# Altium schematic sheet MCU.SchDoc
size A4
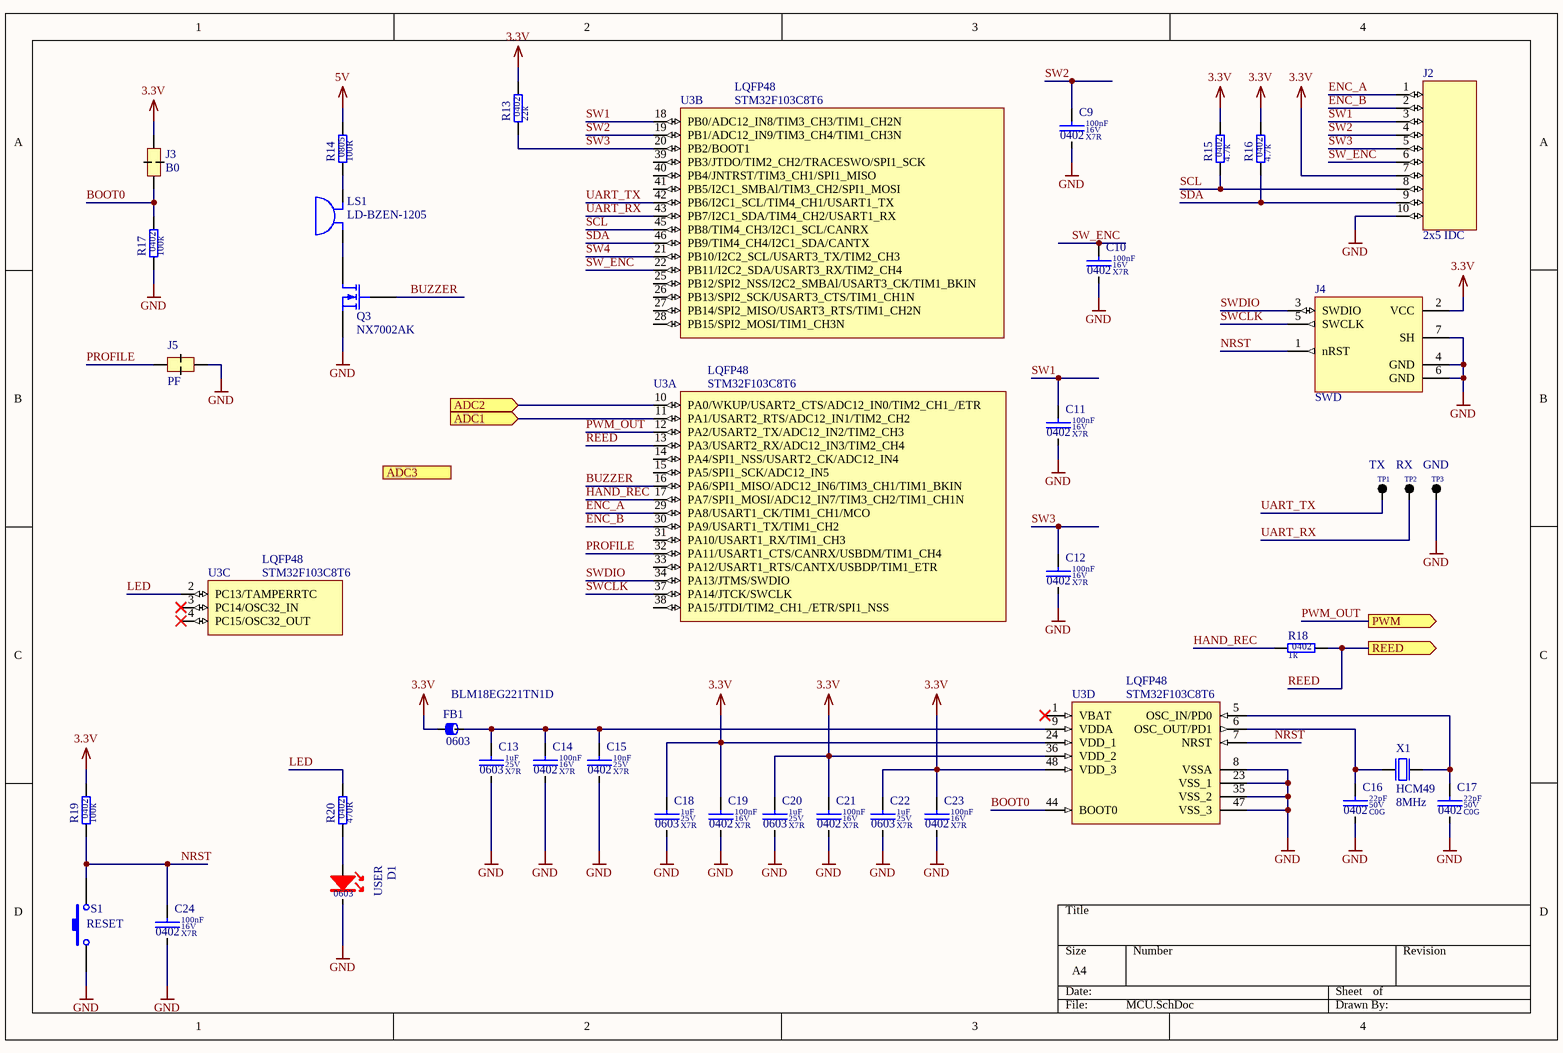
[diagram p0: MCU.SchDoc]

## Parts
C9  value 100nF  Dielectric: X7R  Voltage: 16V  SCH_Footprint: 0402  [C_0402_1005]  (hidden comment: Ceramic X7R)
C10  value 100nF  Dielectric: X7R  Voltage: 16V  SCH_Footprint: 0402  [C_0402_1005]  (hidden comment: Ceramic X7R)
C11  value 100nF  Dielectric: X7R  Voltage: 16V  SCH_Footprint: 0402  [C_0402_1005]  (hidden comment: Ceramic X7R)
C12  value 100nF  Dielectric: X7R  Voltage: 16V  SCH_Footprint: 0402  [C_0402_1005]  (hidden comment: Ceramic X7R)
C13  value 1uF  Dielectric: X7R  Voltage: 25V  SCH_Footprint: 0603  [C_0603_1608]  (hidden comment: Ceramic X7R)
C14  value 100nF  Dielectric: X7R  Voltage: 16V  SCH_Footprint: 0402  [C_0402_1005]  (hidden comment: Ceramic X7R)
C15  value 10nF  Dielectric: X7R  Voltage: 25V  SCH_Footprint: 0402  [C_0402_1005]  (hidden comment: Ceramic X7R)
C16  value 22pF  Dielectric: C0G  Voltage: 50V  SCH_Footprint: 0402  [C_0402_1005]  (hidden comment: Ceramic C0G)
C17  value 22pF  Dielectric: C0G  Voltage: 50V  SCH_Footprint: 0402  [C_0402_1005]  (hidden comment: Ceramic C0G)
C18  value 1uF  Dielectric: X7R  Voltage: 25V  SCH_Footprint: 0603  [C_0603_1608]  (hidden comment: Ceramic X7R)
C19  value 100nF  Dielectric: X7R  Voltage: 16V  SCH_Footprint: 0402  [C_0402_1005]  (hidden comment: Ceramic X7R)
C20  value 1uF  Dielectric: X7R  Voltage: 25V  SCH_Footprint: 0603  [C_0603_1608]  (hidden comment: Ceramic X7R)
C21  value 100nF  Dielectric: X7R  Voltage: 16V  SCH_Footprint: 0402  [C_0402_1005]  (hidden comment: Ceramic X7R)
C22  value 1uF  Dielectric: X7R  Voltage: 25V  SCH_Footprint: 0603  [C_0603_1608]  (hidden comment: Ceramic X7R)
C23  value 100nF  Dielectric: X7R  Voltage: 16V  SCH_Footprint: 0402  [C_0402_1005]  (hidden comment: Ceramic X7R)
C24  value 100nF  Dielectric: X7R  Voltage: 16V  SCH_Footprint: 0402  [C_0402_1005]  (hidden comment: Ceramic X7R)
D1  USER  SCH_Footprint: 0603  [OL_0603_1608]
FB1  value BLM18EG221TN1D  SCH_Footprint: 0603  [FB_0603_1608]  (hidden comment: Ferrite bead)
J2  2x5 IDC  [IDC 2x5 EDGE]
J3  B0  [SOLDER BRIDGE 0402]
J4  SWD  [TagConnectSWD]
J5  PF  [SOLDER BRIDGE 0402]
LS1  LD-BZEN-1205  [LD-BZEN-1205]
Q3  NX7002AK  [NX7002AK.215]
R13  value 22k  SCH_Footprint: 0402  [R_0402_1005]  (hidden comment: Resistor)
R14  value 100R  SCH_Footprint: 0805  [R_0805_2012]  (hidden comment: Resistor)
R15  value 4.7k  SCH_Footprint: 0402  [R_0402_1005]  (hidden comment: Resistor)
R16  value 4.7k  SCH_Footprint: 0402  [R_0402_1005]  (hidden comment: Resistor)
R17  value 100k  SCH_Footprint: 0402  [R_0402_1005]  (hidden comment: Resistor)
R18  value 1k  SCH_Footprint: 0402  [R_0402_1005]  (hidden comment: Resistor)
R19  value 100k  SCH_Footprint: 0402  [R_0402_1005]  (hidden comment: Resistor)
R20  value 470R  SCH_Footprint: 0402  [R_0402_1005]  (hidden comment: Resistor)
S1  RESET  [S_TACTSWITCH3x6]
TP1  TX  [TP_PAD]
TP2  RX  [TP_PAD]
TP3  GND  [TP_PAD]
U3  SCH_Footprint: LQFP48  [LQFP48_7x7]  (hidden comment: STM32F103C8T6)  (parts A,B,C,D of 4)
X1  value 8MHz  SCH_Footprint: HCM49  [X_HC49_SMD]  (hidden comment: 6MHz Crystal)

## Ports
ADC1 (in), ADC2 (in), ADC3 (in), PWM (out), REED (out)

## Nets
3.3V: C18.1 C19.1 C20.1 C21.1 C22.1 C23.1 FB1.1 J2.7 J3.1 J4.2(VCC) R13.2 R15.2 R16.2 R19.2 U3.24(VDD_1) U3.36(VDD_2) U3.48(VDD_3)
5V: R14.2
GND: C9.2 C10.2 C11.2 C12.2 C13.2 C14.2 C15.2 C16.2 C17.2 C18.2 C19.2 C20.2 C21.2 C22.2 C23.2 C24.2 D1.1(K) J2.10 J4.4(GND) J4.6(GND) J4.7(SH) J5.1 Q3.2(S) R17.1 S1.1 TP3.1(TP) U3.8(VSSA) U3.23(VSS_1) U3.35(VSS_2) U3.47(VSS_3)
ADC1: U3.11(PA1/USART2_RTS/ADC12_IN1/TIM2_CH2) ; port ADC1
ADC2: U3.10(PA0/WKUP/USART2_CTS/ADC12_IN0/TIM2_CH1_/ETR) ; port ADC2
BOOT0: J3.2 R17.2 U3.44(BOOT0)
BUZZER: Q3.1(G) U3.16(PA6/SPI1_MISO/ADC12_IN6/TIM3_CH1/TIM1_BKIN)
ENC_A: J2.1 U3.29(PA8/USART1_CK/TIM1_CH1/MCO)
ENC_B: J2.2 U3.30(PA9/USART1_TX/TIM1_CH2)
HAND_REC: R18.1 U3.17(PA7/SPI1_MOSI/ADC12_IN7/TIM3_CH2/TIM1_CH1N)
LED: R20.2 U3.2(PC13/TAMPERRTC)
NRST: C24.1 J4.1(nRST) R19.1 S1.2 U3.7(NRST)
PROFILE: J5.2 U3.32(PA11/USART1_CTS/CANRX/USBDM/TIM1_CH4)
PWM_OUT: U3.12(PA2/USART2_TX/ADC12_IN2/TIM2_CH3) ; port PWM
REED: R18.2 U3.13(PA3/USART2_RX/ADC12_IN3/TIM2_CH4) ; port REED
SCL: J2.8 R15.1 U3.45(PB8/TIM4_CH3/I2C1_SCL/CANRX)
SDA: J2.9 R16.1 U3.46(PB9/TIM4_CH4/I2C1_SDA/CANTX)
SW1: C11.1 J2.3 U3.18(PB0/ADC12_IN8/TIM3_CH3/TIM1_CH2N)
SW2: C9.1 J2.4 U3.19(PB1/ADC12_IN9/TIM3_CH4/TIM1_CH3N)
SW3: C12.1 J2.5 R13.1 U3.20(PB2/BOOT1)
SW4: U3.21(PB10/I2C2_SCL/USART3_TX/TIM2_CH3)
SW_ENC: C10.1 J2.6 U3.22(PB11/I2C2_SDA/USART3_RX/TIM2_CH4)
SWCLK: J4.5(SWCLK) U3.37(PA14/JTCK/SWCLK)
SWDIO: J4.3(SWDIO) U3.34(PA13/JTMS/SWDIO)
UART_RX: TP2.1(TP) U3.43(PB7/I2C1_SDA/TIM4_CH2/USART1_RX)
UART_TX: TP1.1(TP) U3.42(PB6/I2C1_SCL/TIM4_CH1/USART1_TX)
NetC13_1: C13.1 C14.1 C15.1 FB1.2 U3.9(VDDA)
NetC16_1: C16.1 U3.6(OSC_OUT/PD1) X1.1
NetC17_1: C17.1 U3.5(OSC_IN/PD0) X1.2
NetD1_2: D1.2(A) R20.1
NetLS1_1: LS1.1 R14.1
NetLS1_2: LS1.2 Q3.3(D)

Not connected (* = marked no-connect by the designer): U3 1(VBAT)* 3(PC14/OSC32_IN)* 4(PC15/OSC32_OUT)* 14(PA4/SPI1_NSS/USART2_CK/ADC12_IN4) 15(PA5/SPI1_SCK/ADC12_IN5) 25(PB12/SPI2_NSS/I2C2_SMBAl/USART3_CK/TIM1_BKIN) 26(PB13/SPI2_SCK/USART3_CTS/TIM1_CH1N) 27(PB14/SPI2_MISO/USART3_RTS/TIM1_CH2N) 28(PB15/SPI2_MOSI/TIM1_CH3N) 31(PA10/USART1_RX/TIM1_CH3) 33(PA12/USART1_RTS/CANTX/USBDP/TIM1_ETR) 38(PA15/JTDI/TIM2_CH1_/ETR/SPI1_NSS) 39(PB3/JTDO/TIM2_CH2/TRACESWO/SPI1_SCK) 40(PB4/JNTRST/TIM3_CH1/SPI1_MISO) 41(PB5/I2C1_SMBAl/TIM3_CH2/SPI1_MOSI)

## Library data of the parts
C9-C12 C14 C19 C21 C23 C24 = C_100nF_16V_X7R_0402_10: Capacitor; Manufacturer: Murata; Manufacturer Part Number: GRM155R71C104KA88D; Tolerance (%): 10; Part Number: C_100nF_16V_X7R_0402_10; HelpURL: https://www.mouser.com/ds/2/281/c02e-2905.pdf; Supplier 1: TME; Supplier 2: RS Components; Supplier 3: Farnell; Supplier 4: Mouser; Supplier Part Number 4: 81-GRM155R71C104KA88; Supplier 5: Digi-Key
C13 C18 C20 C22 = C_1uF_25V_X7R_0603_10: Capacitor; Manufacturer: Samsung; Manufacturer Part Number: CL10B105KA8NNNC; Tolerance (%): 10; Part Number: C_1uF_25V_X7R_0603_10; HelpURL: http://www.tme.eu/pl/Document/4a42202b32dab16128fe107dd69598cc/samsung-chip-cap.pdf; Supplier 1: TME; Supplier Part Number 1: CL10B105KA8NNNC; Supplier 2: RS Components; Supplier 3: Farnell; Supplier 4: Mouser; Supplier 5: Digi-Key
C15 = C_10nF_25V_X7R_0402_10: Capacitor; Manufacturer: Murata; Manufacturer Part Number: GRM155R71E103KA01D; Tolerance (%): 10; Part Number: C_10nF_25V_X7R_0402_10; HelpURL: http://www.tme.eu/en/Document/e3e731e59cc68b1ab6d46b158bb05733/MURATA_GRM.pdf; Supplier 1: TME; Supplier Part Number 1: GRM155R71E103KA01D; Supplier 2: RS Components; Supplier Part Number 2: 6242301; Supplier 3: Farnell; Supplier Part Number 3: 8819734; Supplier 4: Mouser; Supplier Part Number 4: 81-GRM36X103K25; Supplier 5: Digi-Key; Supplier Part Number 5: 490-1312-1-ND
C16 C17 = C_22pF_50V_C0G_0402_5: Capacitor; Manufacturer: AVX; Manufacturer Part Number: 04025A220JAT2A; Tolerance (%): 5; Part Number: C_22pF_50V_C0G_0402_5; HelpURL: http://datasheet.octopart.com/04025A220JAT2A-AVX-datasheet-9883399.pdf; Supplier 1: TME; Supplier Part Number 1: 04025A220JAT2A; Supplier 2: RS Components; Supplier Part Number 2: 6983087; Supplier 3: Farnell; Supplier Part Number 3: 2280776; Supplier 4: Mouser; Supplier Part Number 4: 581-04025A220J; Supplier 5: Digi-Key; Supplier Part Number 5: 478-1074-1-ND
D1 = OL_R_0603: LED_RED; Manufacturer: Lite-On; Value: LTST-C190KRKT; Part Number: OL_R_0603; HelpURL: https://datasheet.octopart.com/LTST-C190KRKT-Lite-On-datasheet-158191.pdf; Manufacturer Part Number: LTST-C190KRKT; Supplier 1: TME; Supplier Part Number 1: LTST-C190KRKT; Supplier 2: RS Components; Supplier Part Number 2: 1769795; Supplier 3: Farnell; Supplier 4: Mouser; Supplier Part Number 4: 859-LTST-C190KRKT; Supplier 5: Digi-Key; Supplier Part Number 5: 160-1436-1-ND
FB1 = FB_BLM18EG221TN1D: Manufacturer: Murata; Current: 1A; Resistance: 150mR; Part Number: FB_BLM18EG221TN1D; HelpURL: http://datasheet.octopart.com/BLM18EG221TN1D-Murata-datasheet-66919.pdf; Manufacturer Part Number: BLM18EG221TN1D; Supplier 1: TME; Supplier 2: RS Components; Supplier Part Number 2: 7926243P; Supplier 3: Farnell; Supplier Part Number 3: 1515717; Supplier 4: Mouser; Supplier Part Number 4: 81-BLM18EG221TN1D; Supplier 5: Digi-Key; Supplier Part Number 5: 490-5979-1-ND; Supplier 6: LCSC
J2 = IDC_2x5: 2x5 IDC Header
J3 J5 = Solder Bridge: Solder Bridge Jumper
J4 = TagConnectSWD: TagConnect and 1.27mm IDC SWD Header
LS1 = LD-BZEN-1205: Przetwornik dźwięku: elektromagnetyczny; THT; 2,4kHz; 40mA; H: 9mm
Q3 = NX7002AK.215: Tranzystor: N-MOSFET; unipolarny; 60V; 0,12A; 325mW; SOT23
R13 = R_22k_0402_1: Manufacturer: Panasonic; Manufacturer Part Number: ERA-2AEB223X; Voltage: 50V; Power: 63mW; Tolerance: 1%; Part Number: R_22k_0402_1; HelpURL: http://www.mouser.com/ds/2/315/AOA0000C237-1100991.pdf; Supplier 1: TME; Supplier 2: RS Components; Supplier Part Number 2: 566557; Supplier 3: Farnell; Supplier Part Number 3: 1577719; Supplier 4: Mouser; Supplier Part Number 4: 667-ERA-2AEB223X; Supplier 5: Digi-Key; Supplier Part Number 5: P22KDCCT-ND
R14 = R_100R_0805_1: Manufacturer: Yageo; Manufacturer Part Number: RC0805FR-07100RL; Voltage: 150V; Power: 125mW; Tolerance: 1%; Part Number: R_100R_0805_1; HelpURL: https://www.tme.eu/pl/Document/7b8fed8c112f8a94930279c22c957f7f/rc0805yageo.pdf; Supplier 1: TME; Supplier Part Number 1: RC0805FR-07100R; Supplier 2: RS Components; Supplier Part Number 2: 618-5135; Supplier 3: Farnell; Supplier Part Number 3: 9237364; Supplier 4: Mouser; Supplier Part Number 4: 603-RC0805FR-07100RL; Supplier 5: Digi-Key; Supplier Part Number 5: 311-100CRCT-ND
R15-R17 R19 = R_100k_0402_1: Manufacturer: Yageo; Manufacturer Part Number: RC0402FR-07100KL; Voltage: 50V; Power: 63mW; Tolerance: 1%; Part Number: R_100k_0402_1; HelpURL: http://www.tme.eu/pl/Document/1a2bc76e2be68b3b1670068306778ce6/rc0402yageo.pdf; Supplier 1: TME; Supplier Part Number 1: RC0402FR-07100K; Supplier 2: RS Components; Supplier 3: Farnell; Supplier Part Number 3: 2131798; Supplier 4: Mouser; Supplier Part Number 4: 603-RC0402FR-07100KL; Supplier 5: Digi-Key; Supplier Part Number 5: 311-100KLRCT-ND
R18 = R_1k_0402_1: Manufacturer: Yageo; Manufacturer Part Number: RC0402FR-071K; Voltage: 50V; Power: 63mW; Tolerance: 1%; Part Number: R_1k_0402_1; HelpURL: http://www.tme.eu/pl/Document/1a2bc76e2be68b3b1670068306778ce6/rc0402yageo.pdf; Supplier 1: TME; Supplier Part Number 1: RC0402FR-071K; Supplier 2: RS Components; Supplier 3: Farnell; Supplier Part Number 3: 9239235; Supplier 4: Mouser; Supplier Part Number 4: 603-RC0402FR-071KP; Supplier 5: Digi-Key; Supplier Part Number 5: 311-1.00KLRCT-ND
R20 = R_470R_0402_1: Manufacturer: Yageo; Manufacturer Part Number: RC0402FR-07470RL; Voltage: 50V; Power: 63mW; Tolerance: 1%; Part Number: R_470R_0402_1; HelpURL: http://datasheet.octopart.com/RC0402FR-07470RL-Yageo-datasheet-10408619.pdf; Supplier 1: TME; Supplier Part Number 1: RC0402FR-07470R; Supplier 2: RS Components; Supplier 3: Farnell; Supplier Part Number 3: 9239197; Supplier 4: Mouser; Supplier Part Number 4: 603-RC0402FR-07470RL; Supplier 5: Digi-Key; Supplier Part Number 5: 311-470LRCT-ND
S1 = S_TACTSWITCH: Tact Switch; Manufacturer: Ninigi; Manufacturer Part Number: TACTM-34N-F; SCH_Footprint: 3x6mm; Part Number: S_TACTSWITCH; Value: RESET; HelpURL: http://pl.ninigi.com/product/tactm-34n-f/pdf; Supplier 1: TME; Supplier Part Number 1: TACTM-34N-F; Supplier 2: RS Components; Supplier 3: Farnell; Supplier 4: Mouser; Supplier 5: Digi-Key
TP1-TP3 = TP_PAD: Testpoint; SCH_Footprint: SMD; Part Number: TP_PAD; Supplier 1: TME; Supplier 2: RS Components; Supplier 3: Farnell; Supplier 4: Mouser; Supplier 5: Digi-Key; Supplier 6: LCSC
U3 = UP_STM32F103C8T6: Manufacturer: STMicroelectronics; Value: STM32F103C8T6; Part Number: UP_STM32F103C8T6; HelpURL: https://datasheet.octopart.com/STM32F103C8T6-STMicroelectronics-datasheet-48026265.pdf; Manufacturer Part Number: STM32F103C8T6; Supplier 1: TME; Supplier Part Number 1: STM32F103C8T6; Supplier 2: RS Components; Supplier Part Number 2: 1023545; Supplier 3: Farnell; Supplier Part Number 3: 1447637; Supplier 4: Mouser; Supplier Part Number 4: 511-STM32F103C8T6; Supplier 5: Digi-Key; Supplier Part Number 5: 497-6063-ND
X1 = X_6MHz_HCM49: Resonator Ceramic; Manufacturer Part Number: LF XTAL016788; Manufacturer: Ilsi; Part Number: X_6MHz_HCM49; HelpURL: https://www.tme.eu/pl/Document/174d7f33688e5f09d7b9d1d6c85450eb/LFXTAL026900Reel.pdf; Supplier 1: TME; Supplier Part Number 1: 6.00M-SMDHC49R; Supplier 2: RS Components; Supplier Part Number 2: 1463931; Supplier 3: Farnell; Supplier Part Number 3: 9713310; Supplier 4: Mouser; Supplier Part Number 4: 449-LFXTAL016788CUTT; Supplier 5: Digi-Key; Supplier Part Number 5: 1923-1490-1-ND; Supplier 6: LCSC